# EAGLE design main (EAGLE 9.3.0)
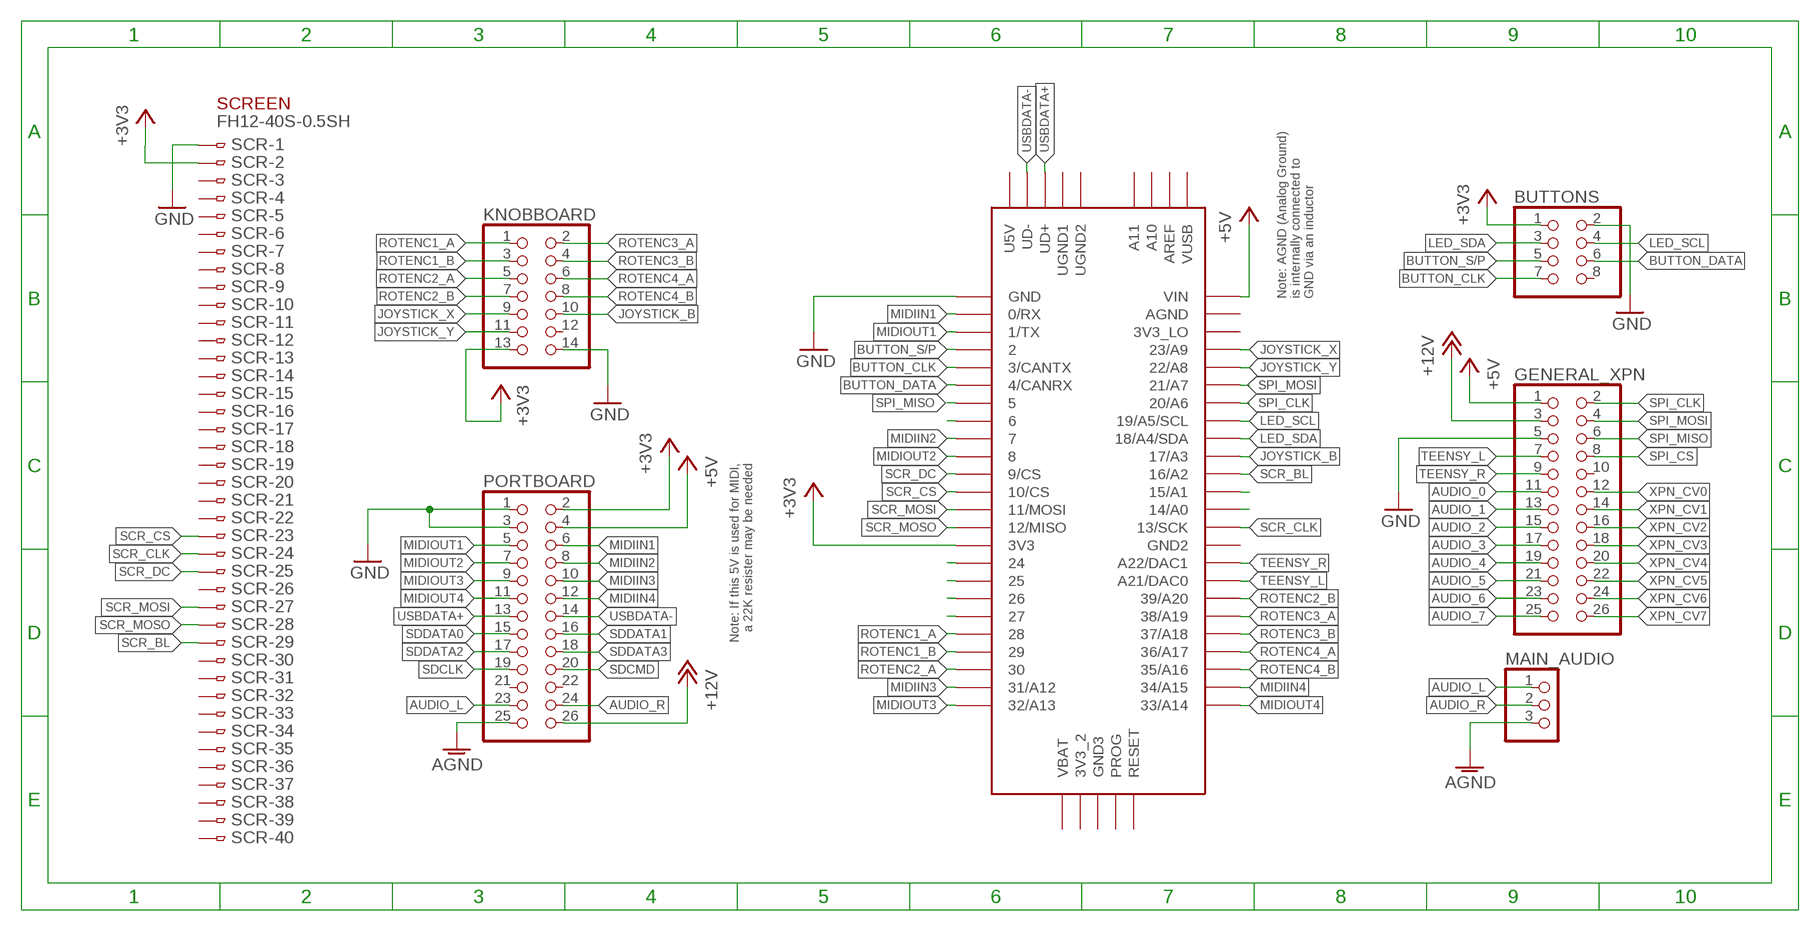
[diagram p0: schematic, sheet 1]

## Parts
BUTTONS  PINHD-2X4  [2X04]
GENERAL_XPN  PINHD-2X13  [2X13]
KNOBBOARD  PINHD-2X7  [2X07]
MAIN_AUDIO  PINHD-1X3  [1X03]
PORTBOARD  PINHD-2X13  [2X13]
SCR  FH12-40S-0.5SH  [FH12-40S-0.5SH]
TEENSY_3.6  TEENSY_3.5/3.6  [TEENSY_3.5/3.6]

## Nets
+3V3: BUTTONS.1 KNOBBOARD.13 PORTBOARD.2 SCR.2 TEENSY_3.6.3V3
+5V: GENERAL_XPN.1 PORTBOARD.4 TEENSY_3.6.VIN
+12V: GENERAL_XPN.3 PORTBOARD.26
AGND: MAIN_AUDIO.3 PORTBOARD.25
AUDIO_0: GENERAL_XPN.11
AUDIO_1: GENERAL_XPN.13
AUDIO_2: GENERAL_XPN.15
AUDIO_3: GENERAL_XPN.17
AUDIO_4: GENERAL_XPN.19
AUDIO_5: GENERAL_XPN.21
AUDIO_6: GENERAL_XPN.23
AUDIO_7: GENERAL_XPN.25
AUDIO_L: MAIN_AUDIO.1 PORTBOARD.23
AUDIO_R: MAIN_AUDIO.2 PORTBOARD.24
BUTTON_CLK: BUTTONS.7 TEENSY_3.6.3/CANTX
BUTTON_DATA: BUTTONS.6 TEENSY_3.6.4/CANRX
BUTTON_S/P: BUTTONS.5 TEENSY_3.6.2
GND: BUTTONS.2 GENERAL_XPN.5 KNOBBOARD.14 PORTBOARD.1 PORTBOARD.3 SCR.1 TEENSY_3.6.GND
JOYSTICK_B: KNOBBOARD.10 TEENSY_3.6.17/A3
JOYSTICK_X: KNOBBOARD.9 TEENSY_3.6.23/A9
JOYSTICK_Y: KNOBBOARD.11 TEENSY_3.6.22/A8
LED_SCL: BUTTONS.4 TEENSY_3.6.19/A5/SCL
LED_SDA: BUTTONS.3 TEENSY_3.6.18/A4/SDA
MIDIIN1: PORTBOARD.6 TEENSY_3.6.0/RX
MIDIIN2: PORTBOARD.8 TEENSY_3.6.7
MIDIIN3: PORTBOARD.10 TEENSY_3.6.31/A12
MIDIIN4: PORTBOARD.12 TEENSY_3.6.34/A15
MIDIOUT1: PORTBOARD.5 TEENSY_3.6.1/TX
MIDIOUT2: PORTBOARD.7 TEENSY_3.6.8
MIDIOUT3: PORTBOARD.9 TEENSY_3.6.32/A13
MIDIOUT4: PORTBOARD.11 TEENSY_3.6.33/A14
N$6: TEENSY_3.6.6
N$9: TEENSY_3.6.24
N$10: TEENSY_3.6.25
N$11: TEENSY_3.6.26
N$12: TEENSY_3.6.27
N$25: TEENSY_3.6.15/A1
N$26: TEENSY_3.6.14/A0
ROTENC1_A: KNOBBOARD.1 TEENSY_3.6.28
ROTENC1_B: KNOBBOARD.3 TEENSY_3.6.29
ROTENC2_A: KNOBBOARD.5 TEENSY_3.6.30
ROTENC2_B: KNOBBOARD.7 TEENSY_3.6.39/A20
ROTENC3_A: KNOBBOARD.2 TEENSY_3.6.38/A19
ROTENC3_B: KNOBBOARD.4 TEENSY_3.6.37/A18
ROTENC4_A: KNOBBOARD.6 TEENSY_3.6.36/A17
ROTENC4_B: KNOBBOARD.8 TEENSY_3.6.35/A16
SCR_BL: SCR.29 TEENSY_3.6.16/A2
SCR_CLK: SCR.24 TEENSY_3.6.13/SCK
SCR_CS: SCR.23 TEENSY_3.6.10/CS
SCR_DC: SCR.25 TEENSY_3.6.9/CS
SCR_MOSI: SCR.27 TEENSY_3.6.11/MOSI
SCR_MOSO: SCR.28 TEENSY_3.6.12/MISO
SDCLK: PORTBOARD.19
SDCMD: PORTBOARD.20
SDDATA0: PORTBOARD.15
SDDATA1: PORTBOARD.16
SDDATA2: PORTBOARD.17
SDDATA3: PORTBOARD.18
SPI_CLK: GENERAL_XPN.2 TEENSY_3.6.20/A6
SPI_CS: GENERAL_XPN.8
SPI_MISO: GENERAL_XPN.6 TEENSY_3.6.5
SPI_MOSI: GENERAL_XPN.4 TEENSY_3.6.21/A7
TEENSY_L: GENERAL_XPN.7 TEENSY_3.6.21/DAC0(A21/DAC0)
TEENSY_R: GENERAL_XPN.9 TEENSY_3.6.A22/DAC1
USBDATA+: PORTBOARD.13 TEENSY_3.6.UD+
USBDATA-: PORTBOARD.14 TEENSY_3.6.UD-
XPN_CV0: GENERAL_XPN.12
XPN_CV1: GENERAL_XPN.14
XPN_CV2: GENERAL_XPN.16
XPN_CV3: GENERAL_XPN.18
XPN_CV4: GENERAL_XPN.20
XPN_CV5: GENERAL_XPN.22
XPN_CV6: GENERAL_XPN.24
XPN_CV7: GENERAL_XPN.26
Unconnected: BUTTONS.8 GENERAL_XPN.10 KNOBBOARD.12 PORTBOARD.21 PORTBOARD.22 SCR.3 SCR.4 SCR.5 SCR.6 SCR.7 SCR.8 SCR.9 SCR.10 SCR.11 SCR.12 SCR.13 SCR.14 SCR.15 SCR.16 SCR.17 SCR.18 SCR.19 SCR.20 SCR.21 SCR.22 SCR.26 SCR.30 SCR.31 SCR.32 SCR.33 SCR.34 SCR.35 SCR.36 SCR.37 SCR.38 SCR.39 SCR.40 TEENSY_3.6.3V3_2 TEENSY_3.6.3V3_LO TEENSY_3.6.A10 TEENSY_3.6.A11 TEENSY_3.6.AGND TEENSY_3.6.AREF TEENSY_3.6.GND2 TEENSY_3.6.GND3 TEENSY_3.6.PROG TEENSY_3.6.RESET TEENSY_3.6.U5V TEENSY_3.6.UGND1 TEENSY_3.6.UGND2 TEENSY_3.6.VBAT TEENSY_3.6.VUSB

## Notes on the sheet
- SCREEN
- Note: AGND (Analog Ground) 
  is internally connected to 
  GND via an inductor
- Note: If this 5V is used for MIDI,
  a 22K resister may be needed

## Library data of the parts
BUTTONS = pinhead:PINHD-2X4: PIN HEADER
GENERAL_XPN PORTBOARD = pinhead:PINHD-2X13: PIN HEADER
KNOBBOARD = pinhead:PINHD-2X7: PIN HEADER
MAIN_AUDIO = pinhead:PINHD-1X3: PIN HEADER
SCR = con-hirose:FH12-40S-0.5S: 0.5mm Pitch Connectors For FPC/FFC Source: Data sheet <http://www.hirose.co.jp/cataloge_hp/e58605370.pdf>; MPN: FH12-40S-0.5SH(55); OC_FARNELL: 1324556; OC_NEWARK: 34M6178
TEENSY_3.6 = Teensy356:TEENSY_3.5/3.6

## Board
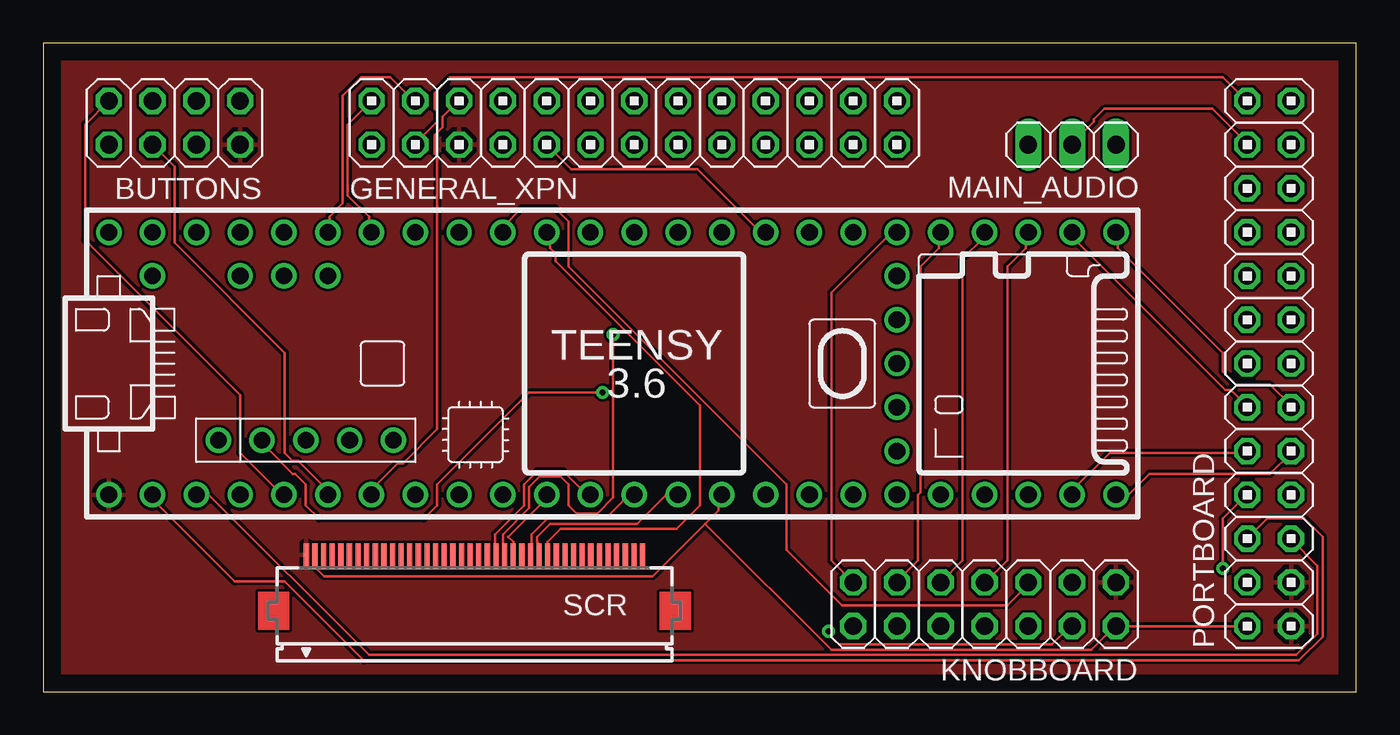
[diagram p1: board, top side]
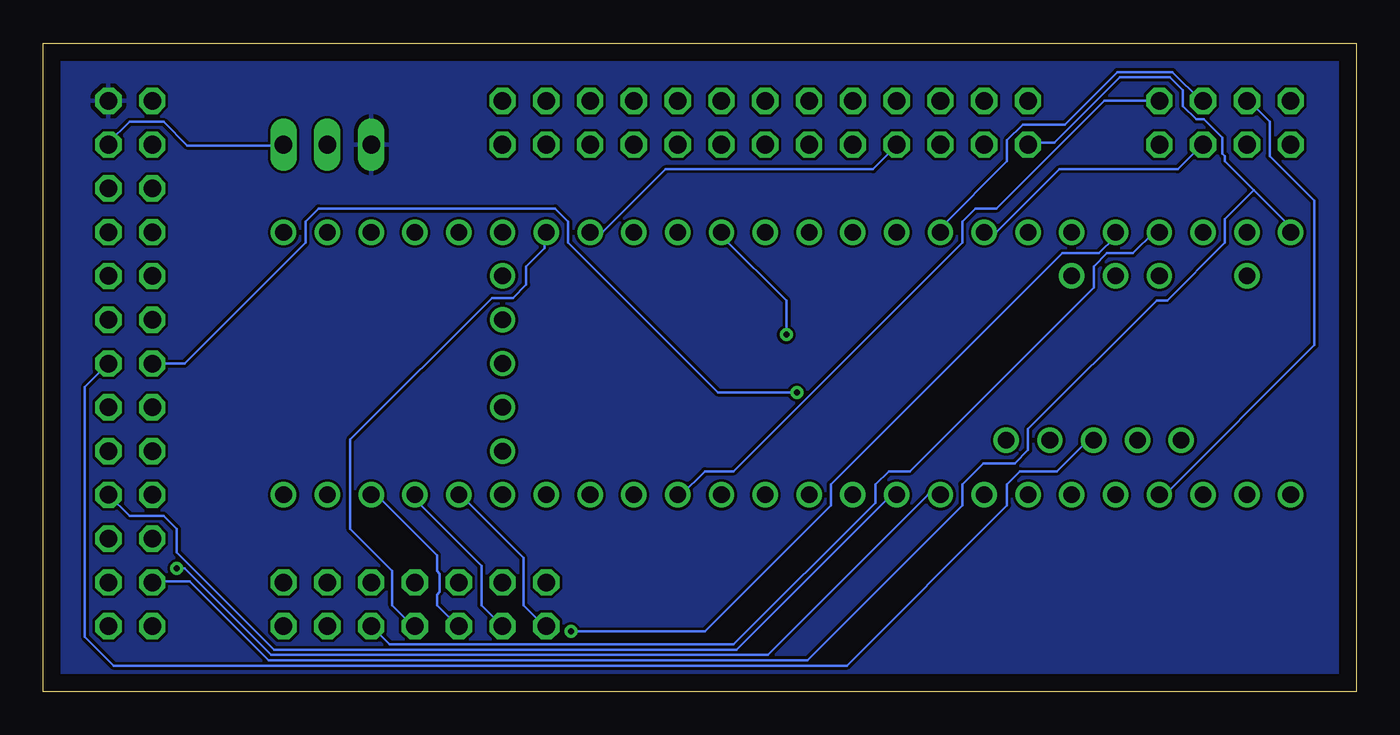
[diagram p2: board, bottom side, seen from below]

Size 76.18 x 37.64 mm. Coordinates in mm from the lower left corner, seen from the top.
Outline: 0,0 76.18,0 76.18,37.64 0,37.64 0,0
Copper layers (1*16): Top 0.035mm / dielectric 1.5mm / Bottom 0.035mm
Design rules "default": minimum track width 6mil, minimum drill 0.35mm, track to track 6mil, track to pad 6mil, pad to pad 6mil, via to via 6mil, smd to smd 6mil, copper to edge 40mil, drill to drill 6mil, minimum pad ring 10mil, minimum via ring 8mil, stop-mask expansion 4mil, vias tented up to drill 0mil, thermal gap 10mil

### Footprints (pad centres in the part's own frame; a part is rotated, then mirrored left to right if it is on the bottom)
2X04 = drill 1.016 octagon: 1 -3.81,-1.27; 2 -3.81,1.27; 3 -1.27,-1.27; 4 -1.27,1.27; 5 1.27,-1.27; 6 1.27,1.27; 7 3.81,-1.27; 8 3.81,1.27
2X13 = drill 1.016 octagon: 1 -15.24,-1.27; 2 -15.24,1.27; 3 -12.7,-1.27; 4 -12.7,1.27; 5 -10.16,-1.27; 6 -10.16,1.27; 7 -7.62,-1.27; 8 -7.62,1.27; 9 -5.08,-1.27; 10 -5.08,1.27; 11 -2.54,-1.27; 12 -2.54,1.27; 13 0,-1.27; 14 0,1.27; 15 2.54,-1.27; 16 2.54,1.27; 17 5.08,-1.27; 18 5.08,1.27; 19 7.62,-1.27; 20 7.62,1.27; 21 10.16,-1.27; 22 10.16,1.27; 23 12.7,-1.27; 24 12.7,1.27; 25 15.24,-1.27; 26 15.24,1.27
2X07 = drill 1.016 octagon: 1 -7.62,-1.27; 2 -7.62,1.27; 3 -5.08,-1.27; 4 -5.08,1.27; 5 -2.54,-1.27; 6 -2.54,1.27; 7 0,-1.27; 8 0,1.27; 9 2.54,-1.27; 10 2.54,1.27; 11 5.08,-1.27; 12 5.08,1.27; 13 7.62,-1.27; 14 7.62,1.27
1X03 = drill 1.016 long: 1 -2.54,0; 2 0,0; 3 2.54,0
FH12-40S-0.5SH = smd 0.3 x 1.3: 1 -9.75,3.25; 2 -9.25,3.25; 3 -8.75,3.25; 4 -8.25,3.25; 5 -7.75,3.25; 6 -7.25,3.25; 7 -6.75,3.25; 8 -6.25,3.25; 9 -5.75,3.25; 10 -5.25,3.25; 11 -4.75,3.25; 12 -4.25,3.25; 13 -3.75,3.25; 14 -3.25,3.25; 15 -2.75,3.25; 16 -2.25,3.25; 17 -1.75,3.25; 18 -1.25,3.25; 19 -0.75,3.25; 20 -0.25,3.25; 21 0.25,3.25; 22 0.75,3.25; 23 1.25,3.25; 24 1.75,3.25; 25 2.25,3.25; 26 2.75,3.25; 27 3.25,3.25; 28 3.75,3.25; 29 4.25,3.25; 30 4.75,3.25; 31 5.25,3.25; 32 5.75,3.25; 33 6.25,3.25; 34 6.75,3.25; 35 7.25,3.25; 36 7.75,3.25; 37 8.25,3.25; 38 8.75,3.25; 39 9.25,3.25; 40 9.75,3.25
TEENSY_3.5/3.6 = drill 0.965: 0/RX -25.4,-7.62; 1/TX -22.86,-7.62; 2 -20.32,-7.62; 3/CANTX -17.78,-7.62; 3V3 7.62,-7.62; 3V3_2 17.78,-2.54; 3V3_LO -22.86,7.62; 4/CANRX -15.24,-7.62; 5 -12.7,-7.62; 6 -10.16,-7.62; 7 -7.62,-7.62; 8 -5.08,-7.62; 9/CS -2.54,-7.62; 10/CS 0,-7.62; 11/MOSI 2.54,-7.62; 12/MISO 5.08,-7.62; 13/SCK 5.08,7.62; 14/A0 2.54,7.62; 15/A1 0,7.62; 16/A2 -2.54,7.62; 17/A3 -5.08,7.62; 18/A4/SDA -7.62,7.62; 19/A5/SCL -10.16,7.62; 20/A6 -12.7,7.62; 21/A7 -15.24,7.62; 21/DAC0 12.7,7.62; 22/A8 -17.78,7.62; 23/A9 -20.32,7.62; 24 10.16,-7.62; 25 12.7,-7.62; 26 15.24,-7.62; 27 17.78,-7.62; 28 20.32,-7.62; 29 22.86,-7.62; 30 25.4,-7.62; 31/A12 27.94,-7.62; 32/A13 30.48,-7.62; 33/A14 30.48,7.62; 34/A15 27.94,7.62; 35/A16 25.4,7.62; 36/A17 22.86,7.62; 37/A18 20.32,7.62; 38/A19 17.78,7.62; 39/A20 15.24,7.62; A10 -17.78,5.08; A11 -15.24,5.08; A22/DAC1 10.16,7.62; AGND -25.4,7.62; AREF -20.32,5.08; GND -27.94,-7.62; GND2 7.62,7.62; GND3 17.78,0; PROG 17.78,2.54; RESET 17.78,5.08; U5V -21.59,-4.445; UD+ -16.51,-4.445; UD- -19.05,-4.445; UGND1 -13.97,-4.445; UGND2 -11.43,-4.445; VBAT 17.78,-5.08; VIN -27.94,7.62; VUSB -25.4,5.08

### Placement (x,y rotation side)
BUTTONS  7.62,33.02 180 top
GENERAL_XPN  34.29,33.02 0 top
KNOBBOARD  54.61,5.08 0 top
MAIN_AUDIO  59.69,31.75 180 top
PORTBOARD  71.12,19.05 90 top
SCR  25.02,4.7 0 top
TEENSY_3.6  31.75,19.05 0 top

### Tracks (layer width: path | path; a pad name or v marks a point on that pad's centre or on a via)
+3V3
  Top 0.152: PORTBOARD.2 KNOBBOARD.13 62.18,3.81 60.81,2.44 45.72,2.44 38.41,9.75 | 38.41,9.75 39.17,10.52 39.17,11.28 39.32,11.43 TEENSY_3.6.3V3 | 38.41,9.75 35.36,6.71 16.31,6.71 15.7,7.32 15.7,7.92 SCR.2
  Bottom 0.152: BUTTONS.1 14.63,34.29 20.88,28.04 22.1,28.04 22.86,27.28 22.86,26.06 36.12,12.8 37.8,12.8 39.17,11.43 TEENSY_3.6.3V3
+5V
  Bottom 0.152: TEENSY_3.6.VIN 3.81,26.98 5.94,29.11 | 5.94,29.11 7.62,30.79 7.62,31.09 7.77,31.24 7.77,32.16 8.84,33.22 9.3,33.22 10.06,33.98 10.06,34.9 10.82,35.66 13.72,35.66 17.53,31.85 19.05,31.85 GENERAL_XPN.1 | 5.94,29.11 7.62,27.43 7.62,26.06 10.97,22.71 11.58,22.71 19.05,15.24 19.05,14.02 19.81,13.26 21.64,13.26 22.86,12.04 22.86,10.82 31.85,1.83 63.09,1.83 67.67,6.4 69.8,6.4 PORTBOARD.4
+12V
  Top 0.152: GENERAL_XPN.3 21.64,31.85 22.86,33.07 22.86,33.68 22.71,33.83 22.71,34.75 23.62,35.66 68.43,35.66 69.8,34.29 PORTBOARD.26
AGND
  pour Bottom: -1.27,38.1 82.55,38.1 83.82,36.83 83.82,-1.27 0,-1.27 -1.27,0
AUDIO_L
  Bottom 0.152: MAIN_AUDIO.1 62.33,31.7 67.82,31.7 69.19,33.07 71.17,33.07 72.39,31.85 PORTBOARD.23
AUDIO_R
  Top 0.152: MAIN_AUDIO.2 59.74,31.85 60.96,33.07 60.96,33.22 61.57,33.83 67.82,33.83 69.8,31.85 PORTBOARD.24
BUTTON_CLK
  Top 0.152: BUTTONS.7 2.44,32.92 2.44,26.21 11.43,17.22 11.43,13.87 13.87,11.43 TEENSY_3.6.3/CANTX
BUTTON_DATA
  Top 0.152: BUTTONS.6 7.62,30.48 7.62,26.06 14.02,19.66 14.02,13.87 14.48,13.41 14.78,13.41 16.46,11.73 16.46,11.43 TEENSY_3.6.4/CANRX
BUTTON_S/P
  Bottom 0.152: TEENSY_3.6.2 11.12,11.43 2.44,20.12 2.44,28.5 5.03,31.09 5.03,33.07 6.25,34.29 BUTTONS.5
GND
  pour Top: -1.27,39.37 82.55,39.37 86.36,35.56 86.36,0 83.82,-2.54 0,-2.54 -2.54,0 -2.54,38.1
JOYSTICK_B
  Top 0.152: TEENSY_3.6.17/A3 26.67,26.98 27.74,28.04 29.72,28.04 30.48,27.28 30.48,24.69 43.13,12.04 43.13,8.23 46.33,5.03 55.93,5.03 57.15,6.25 KNOBBOARD.10
JOYSTICK_X
  Bottom 0.152: TEENSY_3.6.23/A9 11.73,26.67 12.95,25.45 14.48,25.45 15.24,24.69 15.24,23.47 25.91,12.8 27.13,12.8 27.89,12.04 27.89,10.97 36.12,2.74 56.08,2.74 KNOBBOARD.9
JOYSTICK_Y  (via drill 0.35)
  Top 0.152: v45.57,3.5 45.57,3.35 46.18,2.74 58.52,2.74 59.59,3.81 KNOBBOARD.11
  Bottom 0.152: v45.57,3.5 37.8,3.5 30.48,10.82 30.48,12.04 17.07,25.45 14.94,25.45 14.02,26.36 14.02,26.67 TEENSY_3.6.22/A8
LED_SCL
  Bottom 0.152: TEENSY_3.6.19/A5/SCL 20.88,26.67 17.22,30.33 10.36,30.33 8.99,31.7 BUTTONS.4
LED_SDA
  Bottom 0.152: TEENSY_3.6.18/A4/SDA 24.08,26.67 24.08,26.98 20.27,30.79 20.27,32 19.36,32.92 16.92,32.92 13.87,35.97 10.67,35.97 8.99,34.29 BUTTONS.3
MIDIIN1
  Top 0.152: PORTBOARD.6 71.02,10.06 73.15,10.06 74.22,8.99 74.22,3.2 72.85,1.83 18.59,1.83 14.02,6.4 11.12,6.4 6.4,11.12 6.4,11.43 TEENSY_3.6.0/RX
MIDIIN2  (via drill 0.35)
  Top 0.152: v68.43,7.16 68.43,10.06 69.8,11.43 PORTBOARD.8
  Bottom 0.152: TEENSY_3.6.7 24.84,11.43 34.14,2.13 62.94,2.13 67.97,7.16 v68.43,7.16
MIDIIN3
  Top 0.152: TEENSY_3.6.31/A12 59.74,11.43 59.74,11.73 61.87,13.87 69.8,13.87 PORTBOARD.10
MIDIIN4
  Top 0.152: TEENSY_3.6.34/A15 59.74,26.67 59.74,26.36 68.58,17.53 68.89,17.53 69.8,16.61 PORTBOARD.12
MIDIOUT1
  Top 0.152: TEENSY_3.6.1/TX 9.6,11.43 18.9,2.13 72.69,2.13 73.91,3.35 73.91,7.32 72.39,8.84 PORTBOARD.5
MIDIOUT2
  Bottom 0.152: TEENSY_3.6.8 26.98,11.43 35.97,2.44 62.79,2.44 68.43,8.08 68.43,9.45 69.19,10.21 71.17,10.21 PORTBOARD.7
MIDIOUT3
  Top 0.152: TEENSY_3.6.32/A13 62.94,11.43 64.16,12.65 71.17,12.65 72.39,13.87 PORTBOARD.9
MIDIOUT4
  Top 0.152: TEENSY_3.6.33/A14 62.33,26.67 62.33,25.76 68.43,19.66 68.43,18.59 69.19,17.83 71.17,17.83 72.39,16.61 PORTBOARD.11
ROTENC1_A
  Bottom 0.152: TEENSY_3.6.28 51.97,11.43 48.31,7.77 48.31,5.03 47.09,3.81 KNOBBOARD.1
ROTENC1_B
  Bottom 0.152: KNOBBOARD.3 50.75,5.03 50.75,7.32 54.56,11.12 54.56,11.43 TEENSY_3.6.29
ROTENC2_A
  Bottom 0.152: TEENSY_3.6.30 56.84,11.43 53.34,7.92 53.34,7.01 53.19,6.86 53.19,5.79 53.34,5.64 53.34,5.03 52.12,3.81 KNOBBOARD.5
ROTENC2_B
  Bottom 0.152: TEENSY_3.6.39/A20 47.09,26.67 47.09,25.76 48.16,24.69 48.16,23.62 48.92,22.86 50.14,22.86 58.37,14.63 58.37,9.45 55.93,7.01 55.93,5.03 54.71,3.81 KNOBBOARD.7
ROTENC3_A
  Top 0.152: TEENSY_3.6.38/A19 49.23,26.67 45.72,23.16 45.72,7.62 KNOBBOARD.2
ROTENC3_B
  Top 0.152: TEENSY_3.6.37/A18 51.97,26.67 51.97,25.76 50.9,24.69 50.9,11.58 50.75,11.43 50.75,7.62 49.53,6.4 KNOBBOARD.4
ROTENC4_A
  Top 0.152: KNOBBOARD.6 53.34,7.62 53.34,25.15 54.56,26.36 54.56,26.67 TEENSY_3.6.36/A17
ROTENC4_B
  Top 0.152: TEENSY_3.6.35/A16 57.15,26.06 57,25.91 57,25.76 55.93,24.69 55.93,7.62 54.71,6.4 KNOBBOARD.8
SCR_BL
  Top 0.152: SCR.29 29.26,8.08 29.26,8.69 30.02,9.45 36.73,9.45 38.1,10.82 38.1,16.61 29.72,24.99 29.72,25.45 29.41,25.76 29.41,26.52 29.26,26.67 TEENSY_3.6.16/A2
SCR_CLK  (via drill 0.35)
  Top 0.152: v33.07,20.73 33.07,11.28 32.16,10.36 30.94,10.36 30.48,10.82 30.48,12.04 30.02,12.5 28.8,12.5 28.19,11.89 28.19,10.67 26.67,9.14 26.67,8.08 SCR.24
  Bottom 0.152: v33.07,20.73 33.07,22.71 36.73,26.36 36.73,26.67 TEENSY_3.6.13/SCK
SCR_CS
  Top 0.152: TEENSY_3.6.10/CS 31.55,11.43 30.18,12.8 28.65,12.8 27.89,12.04 27.89,10.82 26.21,9.14 26.21,8.08 SCR.23
SCR_DC
  Top 0.152: SCR.25 27.28,8.08 27.28,8.69 26.98,8.99 29.11,11.12 29.11,11.43 TEENSY_3.6.9/CS
SCR_MOSI
  Top 0.152: TEENSY_3.6.11/MOSI 33.98,11.43 32.61,10.06 29.26,10.06 28.35,9.14 28.35,8.08 SCR.27
SCR_MOSO
  Top 0.152: TEENSY_3.6.12/MISO 36.12,11.43 34.44,9.75 29.41,9.75 28.65,8.99 28.65,8.69 28.8,8.53 28.8,8.08 SCR.28
SPI_CLK
  Top 0.152: TEENSY_3.6.20/A6 19.05,27.28 18.9,27.43 18.9,27.58 17.68,28.8 17.68,32.92 GENERAL_XPN.2
SPI_MISO
  Top 0.152: TEENSY_3.6.5 19.05,11.73 20.57,13.26 20.88,13.26 22.86,15.24 22.86,31.09 22.71,31.24 22.71,32.31 23.16,32.77 23.16,33.38 24.08,34.29 GENERAL_XPN.6
SPI_MOSI
  Top 0.152: TEENSY_3.6.21/A7 16.61,26.67 16.61,27.58 17.37,28.35 17.37,34.59 18.44,35.66 20.12,35.66 21.49,34.29 GENERAL_XPN.4
TEENSY_L
  Bottom 0.152: TEENSY_3.6.21/DAC0 43.74,26.67 40.08,30.33 28.04,30.33 26.67,31.7 GENERAL_XPN.7
TEENSY_R
  Top 0.152: TEENSY_3.6.A22/DAC1 41.6,26.67 37.95,30.33 30.63,30.33 GENERAL_XPN.9
USBDATA+
  Bottom 0.152: PORTBOARD.13 73.76,17.68 73.76,3.2 72.08,1.52 29.57,1.52 20.27,10.82 20.27,12.04 19.51,12.8 17.37,12.8 15.7,14.48 15.24,14.48 TEENSY_3.6.UD+
USBDATA-  (via drill 0.35)
  Top 0.152: v32.46,17.37 28.19,17.37 22.86,12.04 22.86,10.82 22.1,10.06 16,10.06 15.24,10.82 15.24,12.04 14.63,12.65 14.48,12.65 13.11,14.02 13.11,14.17 12.8,14.48 TEENSY_3.6.UD-
  Bottom 0.152: v32.46,17.37 37.03,17.37 45.72,26.06 45.72,27.28 46.48,28.04 60.2,28.04 60.96,27.28 60.96,26.06 67.97,19.05 PORTBOARD.14